# Altium schematic sheet C-08 SODIMM.SchDoc
size 513 x 386 mm
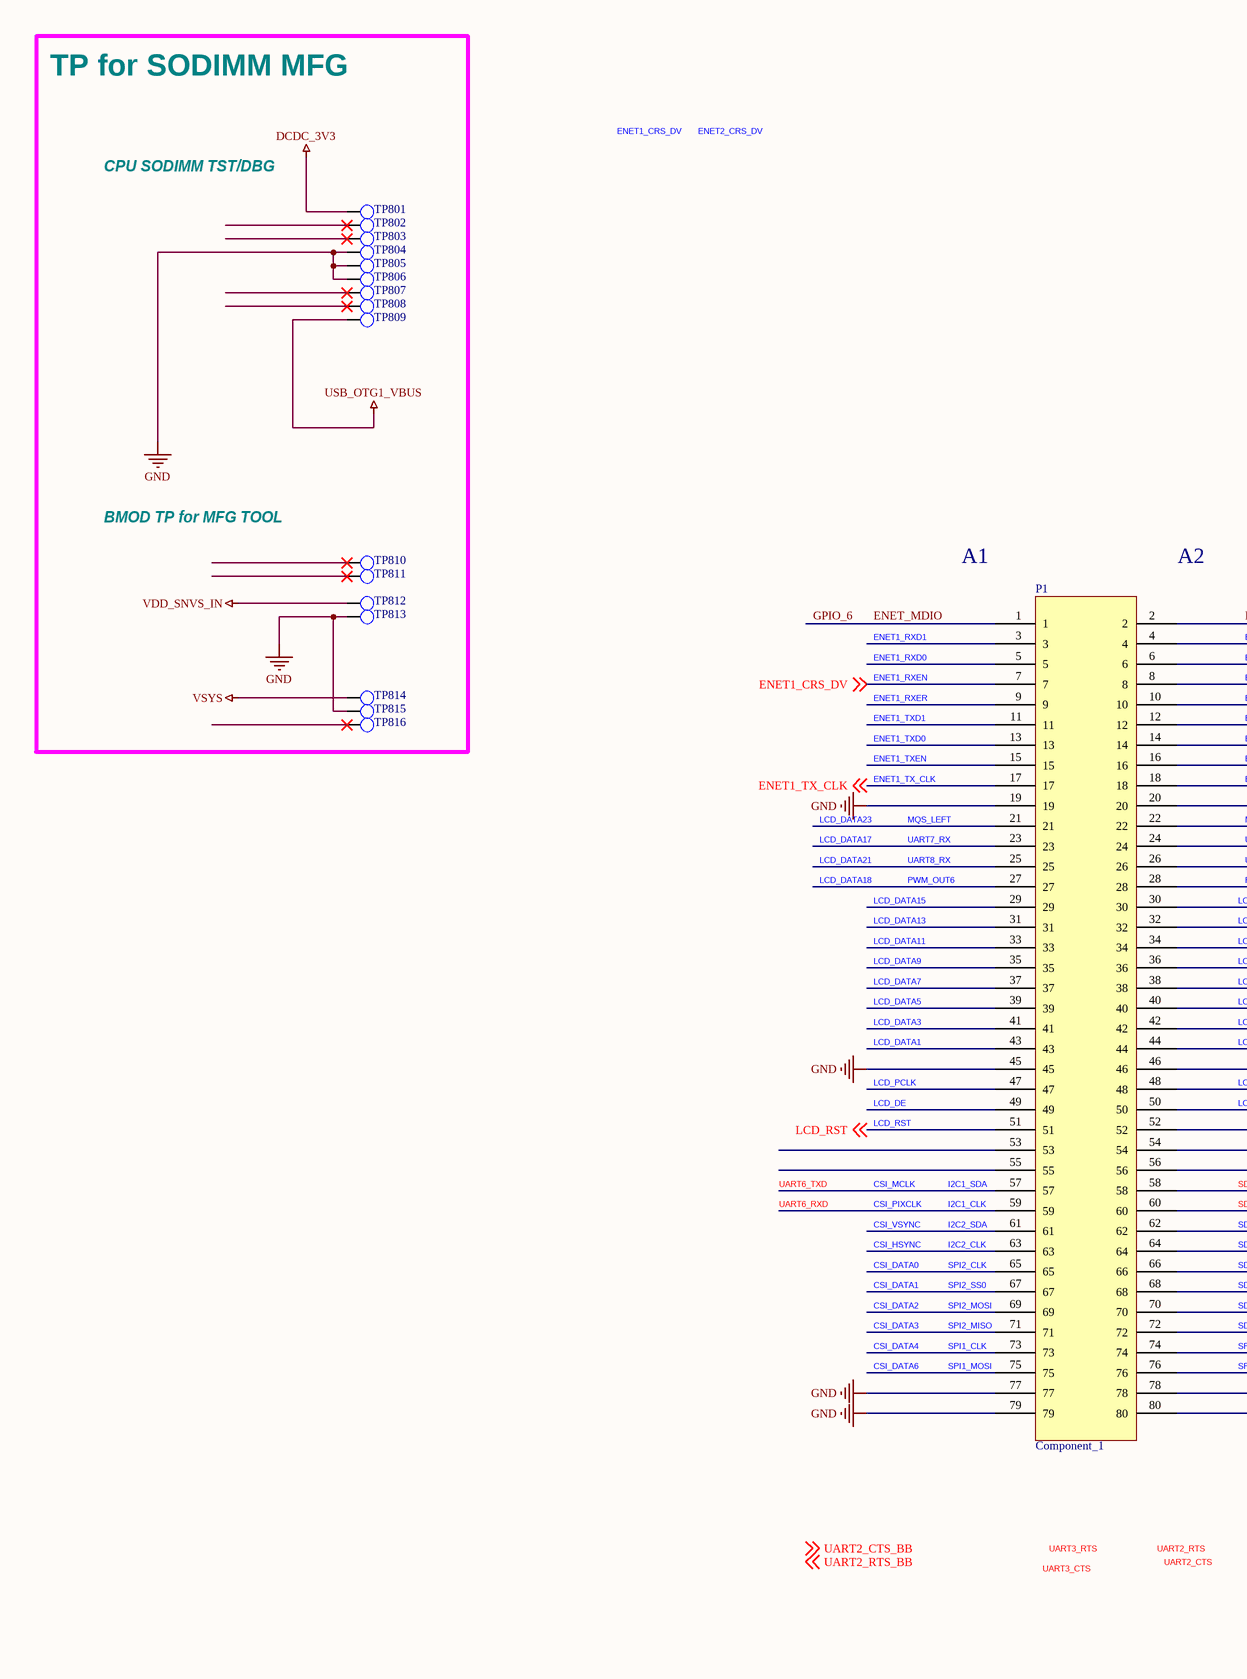
[diagram p0: C-08 SODIMM.SchDoc, left]
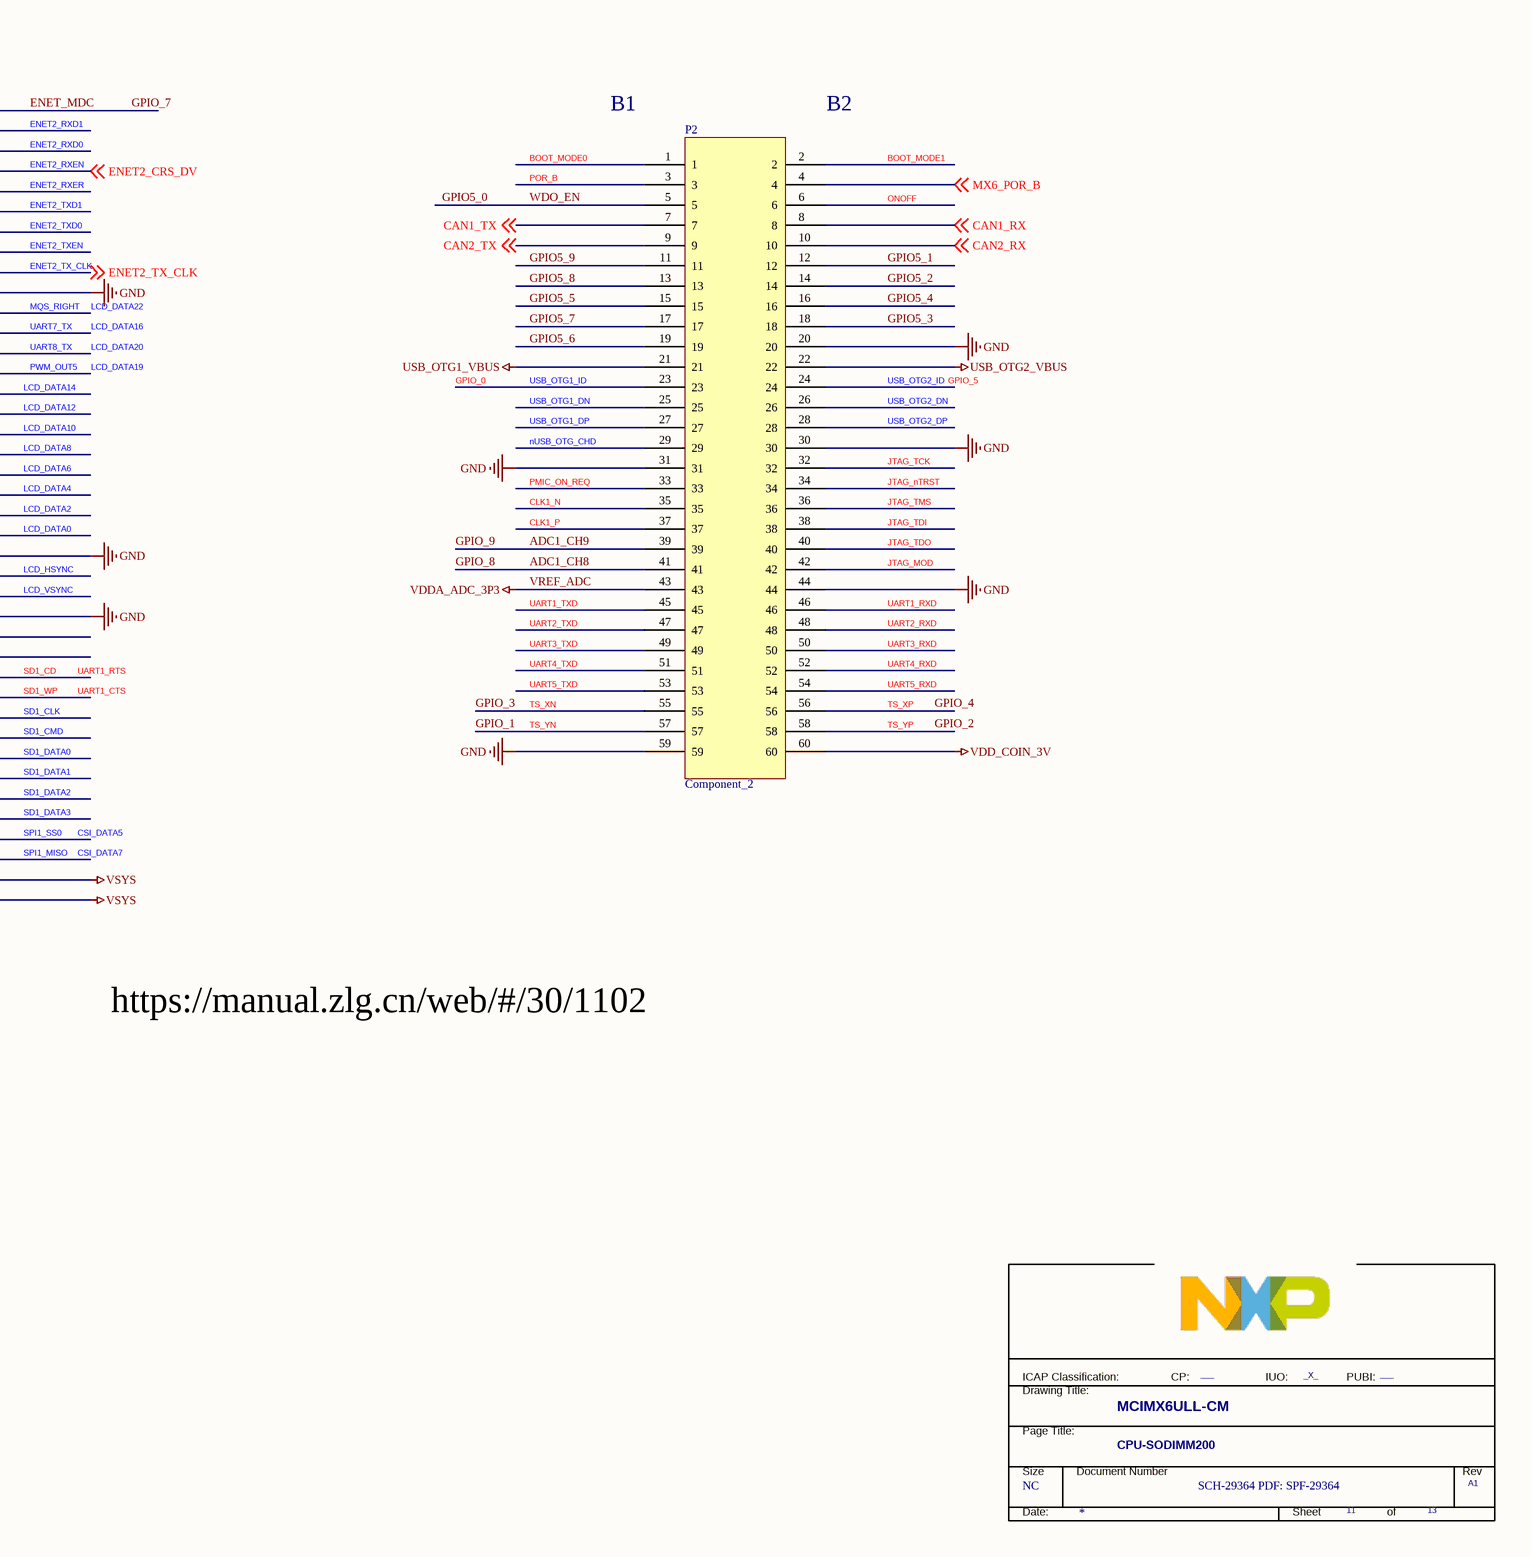
[diagram p1: C-08 SODIMM.SchDoc, right]

## Parts
*  PageTitle: CPU-SODIMM200  Page Count: 13  Page Number: 11  Page Size: NC  Title: MCIMX6ULL-CM  RevCode: A1  Doc: SCH-29364 PDF: SPF-29364  FCP: ___  FIUO: _X_  (hidden comment: TitleBlock_FS)  (graphical)
P1  Component_1  [CONN-SMD_80P-P0.50_HRS_DF12NB3.0-80DP-0.5V]
P2  Component_2  [CONN-SMD_60P-P0.50_HRS_DF12NB3.0-60DS-0.5V-51]
TP801  TP_35MIL  [testpoint_35mil]  (value not drawn)
TP802  TP_35MIL  [testpoint_35mil]  (value not drawn)
TP803  TP_35MIL  [testpoint_35mil]  (value not drawn)
TP804  TP_35MIL  [testpoint_35mil]  (value not drawn)
TP805  TP_35MIL  [testpoint_35mil]  (value not drawn)
TP806  TP_35MIL  [testpoint_35mil]  (value not drawn)
TP807  TP_35MIL  [testpoint_35mil]  (value not drawn)
TP808  TP_35MIL  [testpoint_35mil]  (value not drawn)
TP809  TP_35MIL  [testpoint_35mil]  (value not drawn)
TP810  TP_35MIL  [testpoint_35mil]  (value not drawn)
TP811  TP_35MIL  [testpoint_35mil]  (value not drawn)
TP812  TP_35MIL  [TPAD_015]  (value not drawn)
TP813  TP_35MIL  [testpoint_35mil]  (value not drawn)
TP814  TP_35MIL  [testpoint_35mil]  (value not drawn)
TP815  TP_35MIL  [testpoint_35mil]  (value not drawn)
TP816  TP_35MIL  [testpoint_35mil]  (value not drawn)

## Blocks framed on the sheet
TP for SODIMM MFG: TP801-TP816

## Nets
DCDC_3V3: TP801.1(TP)
GND: P1.19 P1.20 P1.45 P1.46 P1.52 P1.77 P1.79 P2.20 P2.30 P2.31 P2.44 P2.59 TP804.1(TP) TP805.1(TP) TP806.1(TP) TP813.1(TP) TP815.1(TP)
USB_OTG1_VBUS: P2.21 TP809.1(TP)
USB_OTG2_VBUS: P2.22
VDD_COIN_3V: P2.60
VDD_SNVS_IN: TP812.1(TP)
VREF_ADC: P2.43  [also labelled VDDA_ADC_3P3]
VSYS: P1.78 P1.80 TP814.1(TP)
ADC1_CH8: P2.41  [also labelled GPIO_8]
ADC1_CH9: P2.39  [also labelled GPIO_9]
BOOT_MODE0: P2.1
BOOT_MODE1: P2.2
CAN1_RX: P2.8 ; off-sheet CAN1_RX
CAN1_TX: P2.7 ; off-sheet CAN1_TX
CAN2_RX: P2.10 ; off-sheet CAN2_RX
CAN2_TX: P2.9 ; off-sheet CAN2_TX
CLK1_N: P2.35
CLK1_P: P2.37
CSI_DATA0: P1.65  [also labelled SPI2_CLK]
CSI_DATA1: P1.67  [also labelled SPI2_SS0]
CSI_DATA2: P1.69  [also labelled SPI2_MOSI]
CSI_DATA3: P1.71  [also labelled SPI2_MISO]
CSI_DATA4: P1.73  [also labelled SPI1_CLK]
CSI_DATA5: P1.74  [also labelled SPI1_SS0]
CSI_DATA6: P1.75  [also labelled SPI1_MOSI]
CSI_DATA7: P1.76  [also labelled SPI1_MISO]
CSI_HSYNC: P1.63  [also labelled I2C2_CLK]
CSI_MCLK: P1.57  [also labelled I2C1_SDA, UART6_TXD]
CSI_PIXCLK: P1.59  [also labelled I2C1_CLK, UART6_RXD]
CSI_VSYNC: P1.61  [also labelled I2C2_SDA]
ENET1_RXD0: P1.5
ENET1_RXD1: P1.3
ENET1_RXEN: P1.7 ; off-sheet ENET1_CRS_DV  [also labelled ENET1_CRS_DV]
ENET1_RXER: P1.9
ENET1_TX_CLK: P1.17 ; off-sheet ENET1_TX_CLK
ENET1_TXD0: P1.13
ENET1_TXD1: P1.11
ENET1_TXEN: P1.15
ENET2_RXD0: P1.6
ENET2_RXD1: P1.4
ENET2_RXEN: P1.8 ; off-sheet ENET2_CRS_DV  [also labelled ENET2_CRS_DV]
ENET2_RXER: P1.10
ENET2_TX_CLK: P1.18 ; off-sheet ENET2_TX_CLK
ENET2_TXD0: P1.14
ENET2_TXD1: P1.12
ENET2_TXEN: P1.16
ENET_MDC: P1.2  [also labelled GPIO_7]
ENET_MDIO: P1.1  [also labelled GPIO_6]
GPIO5_0: P2.5  [also labelled WDO_EN]
GPIO5_1: P2.12
GPIO5_2: P2.14
GPIO5_3: P2.18
GPIO5_4: P2.16
GPIO5_5: P2.15
GPIO5_6: P2.19
GPIO5_7: P2.17
GPIO5_8: P2.13
GPIO5_9: P2.11
GPIO_0: P2.23  [also labelled USB_OTG1_ID]
GPIO_1: P2.57  [also labelled TS_YN]
GPIO_2: P2.58  [also labelled TS_YP]
GPIO_3: P2.55  [also labelled TS_XN]
GPIO_4: P2.56  [also labelled TS_XP]
GPIO_5: P2.24  [also labelled USB_OTG2_ID]
JTAG_MOD: P2.42
JTAG_nTRST: P2.34
JTAG_TCK: P2.32
JTAG_TDI: P2.38
JTAG_TDO: P2.40
JTAG_TMS: P2.36
LCD_DATA0: P1.44
LCD_DATA1: P1.43
LCD_DATA2: P1.42
LCD_DATA3: P1.41
LCD_DATA4: P1.40
LCD_DATA5: P1.39
LCD_DATA6: P1.38
LCD_DATA7: P1.37
LCD_DATA8: P1.36
LCD_DATA9: P1.35
LCD_DATA10: P1.34
LCD_DATA11: P1.33
LCD_DATA12: P1.32
LCD_DATA13: P1.31
LCD_DATA14: P1.30
LCD_DATA15: P1.29
LCD_DATA16: P1.24  [also labelled UART7_TX]
LCD_DATA17: P1.23  [also labelled UART7_RX]
LCD_DATA18: P1.27  [also labelled PWM_OUT6]
LCD_DATA19: P1.28  [also labelled PWM_OUT5]
LCD_DATA20: P1.26  [also labelled UART8_TX]
LCD_DATA21: P1.25  [also labelled UART8_RX]
LCD_DATA22: P1.22  [also labelled MQS_RIGHT]
LCD_DATA23: P1.21  [also labelled MQS_LEFT]
LCD_DE: P1.49
LCD_HSYNC: P1.48
LCD_PCLK: P1.47
LCD_RST: P1.51 ; off-sheet LCD_RST
LCD_VSYNC: P1.50
MX6_POR_B: P2.4 ; off-sheet MX6_POR_B
nUSB_OTG_CHD: P2.29
ONOFF: P2.6
PMIC_ON_REQ: P2.33
POR_B: P2.3
SD1_CD: P1.58  [also labelled UART1_RTS]
SD1_CLK: P1.62
SD1_CMD: P1.64
SD1_DATA0: P1.66
SD1_DATA1: P1.68
SD1_DATA2: P1.70
SD1_DATA3: P1.72
SD1_WP: P1.60  [also labelled UART1_CTS]
UART1_RXD: P2.46
UART1_TXD: P2.45
UART2_RXD: P2.48
UART2_TXD: P2.47
UART3_RXD: P2.50
UART3_TXD: P2.49
UART4_RXD: P2.52
UART4_TXD: P2.51
UART5_RXD: P2.54
UART5_TXD: P2.53
USB_OTG1_DN: P2.25
USB_OTG1_DP: P2.27
USB_OTG2_DN: P2.26
USB_OTG2_DP: P2.28

Not connected (* = marked no-connect by the designer): P1 53 54 55 56; TP802 1(TP)*; TP803 1(TP)*; TP807 1(TP)*; TP808 1(TP)*; TP810 1(TP)*; TP811 1(TP)*; TP816 1(TP)*

## Notes on the sheet
- CPU SODIMM TST/DBG
- BMOD TP for MFG TOOL
- A1
- A2
- B1
- B2
- https://manual.zlg.cn/web/#/30/1102
- Labels drawn without touching a wire or pin: ENET1_CRS_DV, ENET2_CRS_DV, UART2_CTS, UART2_CTS_BB, UART2_RTS, UART2_RTS_BB, UART3_CTS, UART3_RTS
- (in symbol TitleBlock_FS) ICAP Classification:; CP:; IUO:; PUBI:; Drawing Title:; Page Title:; Size; Document Number; Rev; Date:; Sheet; of

## Library data of the parts
* = TitleBlock_FS: OrgAddr2: Austin, TX 78735-8598; OrgAddr1: 6501 William Cannon Drive West; OrgName: Freescale Semiconductor; Page Create Date: March  8, 1995; PUBI: ___; Page Modify Date: *
TP801-TP810 TP814-TP816 = T POINT R: TEST POINT PAD .035 SMT, no part to order; CLASS: IC; AGILE_PN: 510-75618; CAD_APPROVED: Yes; ROHS: Yes; HEIGHT: 0.1MM; PCB Footprint: testpoint_35mil
TP811 TP813 = T POINT R: TEST POINT PAD .035 SMT, no part to order; CLASS: IC; CAD_APPROVED: Yes; AGILE_PN: 510-75618; HEIGHT: 0.1MM; ROHS: Yes; PCB Footprint: testpoint_35mil
TP812 = T POINT R: TEST POINT PAD .035 SMT, no part to order; CLASS: IC; CAD_APPROVED: Yes; AGILE_PN: 510-75618; PCB Footprint: testpoint_35mil; HEIGHT: 0.1MM; ROHS: Yes